# Altium schematic sheet BMS_Connectors.SchDoc: Connectors
size A4; SheetNumber: 2; SheetTotal: 5
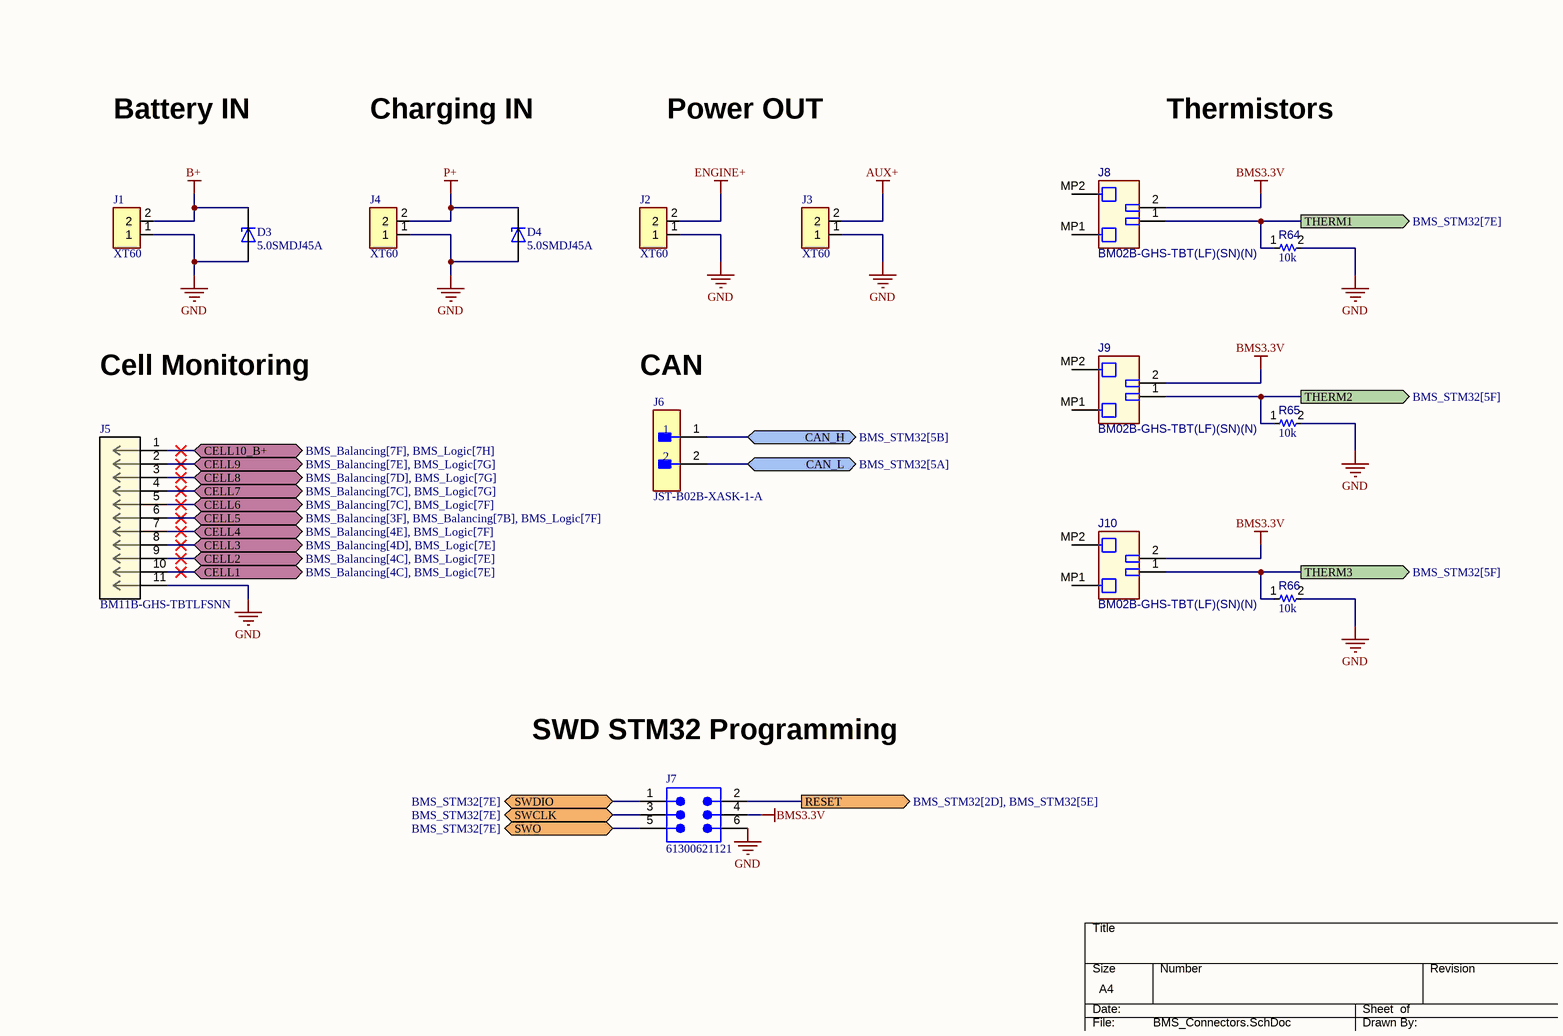
[diagram p0: BMS_Connectors.SchDoc]

## Parts
D3  5.0SMDJ45A  [DIOM7959X262N]
D4  5.0SMDJ45A  [DIOM7959X262N]
J1  XT60  [AMASS_XT60PB-M]
J2  XT60  [AMASS_XT60PB-M]
J3  XT60  [AMASS_XT60PB-M]
J4  XT60  [AMASS_XT60PB-M]
J5  BM11B-GHS-TBTLFSNN  [CONN11_BM11B-GHS-TBTLFSNN_JST]
J6  JST-B02B-XASK-1-A  [FP-B02B-XASK-1-A_LF_SN-MFG]
J7  61300621121  [61300621121]
J8  BM02B-GHS-TBT(LF)(SN)(N)  [JST-BM02B-GHS-TBT_V]
J9  BM02B-GHS-TBT(LF)(SN)(N)  [JST-BM02B-GHS-TBT_V]
J10  BM02B-GHS-TBT(LF)(SN)(N)  [JST-BM02B-GHS-TBT_V]
R64  value 10k  [RESC0402(1005)_L]  (hidden comment: RC0402FR-0710KL)
R65  value 10k  [RESC0402(1005)_L]  (hidden comment: RC0402FR-0710KL)
R66  value 10k  [RESC0402(1005)_L]  (hidden comment: RC0402FR-0710KL)

## Ports
CAN_H (bidir, see BMS_STM32[5B]), CAN_L (bidir, see BMS_STM32[5A]), CELL1 (bidir, see BMS_Balancing[4C], BMS_Logic[7E]), CELL2 (bidir, see BMS_Balancing[4C], BMS_Logic[7E]), CELL3 (bidir, see BMS_Balancing[4D], BMS_Logic[7E]), CELL4 (bidir, see BMS_Balancing[4E], BMS_Logic[7F]), CELL5 (bidir, see BMS_Balancing[3F], BMS_Balancing[7B], BMS_Logic[7F]), CELL6 (bidir, see BMS_Balancing[7C], BMS_Logic[7F]), CELL7 (bidir, see BMS_Balancing[7C], BMS_Logic[7G]), CELL8 (bidir, see BMS_Balancing[7D], BMS_Logic[7G]), CELL9 (bidir, see BMS_Balancing[7E], BMS_Logic[7G]), CELL10_B+ (bidir, see BMS_Balancing[7F], BMS_Logic[7H]), RESET (out, see BMS_STM32[2D], BMS_STM32[5E]), SWCLK (bidir, see BMS_STM32[7E]), SWDIO (bidir, see BMS_STM32[7E]), SWO (bidir, see BMS_STM32[7E]), THERM1 (out, see BMS_STM32[7E]), THERM2 (out, see BMS_STM32[5F]), THERM3 (out, see BMS_STM32[5F])

## Nets
AUX+: J3.2
B+: D3.C J1.2
BMS3.3V: J7.4 J8.2 J9.2 J10.2
ENGINE+: J2.2
GND: D3.A D4.A J1.1 J2.1 J3.1 J4.1 J5.11 J7.6 R64.2 R65.2 R66.2
P+: D4.C J4.2
CAN_H: J6.1 ; port CAN_H
CAN_L: J6.2 ; port CAN_L
CELL1: J5.10 ; port CELL1
CELL2: J5.9 ; port CELL2
CELL3: J5.8 ; port CELL3
CELL4: J5.7 ; port CELL4
CELL5: J5.6 ; port CELL5
CELL6: J5.5 ; port CELL6
CELL7: J5.4 ; port CELL7
CELL8: J5.3 ; port CELL8
CELL9: J5.2 ; port CELL9
CELL10_B+: J5.1 ; port CELL10_B+
RESET: J7.2 ; port RESET
SWCLK: J7.3 ; port SWCLK
SWDIO: J7.1 ; port SWDIO
SWO: J7.5 ; port SWO
THERM1: J8.1 R64.1 ; port THERM1
THERM2: J9.1 R65.1 ; port THERM2
THERM3: J10.1 R66.1 ; port THERM3

Not connected (* = marked no-connect by the designer): J8 MP1 MP2; J9 MP1 MP2; J10 MP1 MP2

## Notes on the sheet
- Battery IN
- Charging IN
- Power OUT
- Thermistors
- Cell Monitoring
- CAN
- SWD STM32 Programming
- DWG NO:
- REV:
- THIS DOCUMENT AND THE DATA DISCLOSED HEREIN OR
- HEREWITH IS THE PROPERTY OF ALTIUM LIMITED AND MAY
- BE FREELY DISTRIBUTED IN WHOLE. NO RIGHTS ARE
- RESERVED OR EXPRESS OR IMPLIED WARANTEE GIVEN.
- REVISION
- DESCRIPTION
- DATE
- APPROVED
- ENG:
- APPROVALS
- PROJECT
- DSN:
- CHK:
- REFERENCE DOCUMENTS
- PROJECT REVISION:
- TITLE
- DOCUMENT REVISION:
- DESIGN ITEM:
- BOM:
- FAB DWG:
- PCB DWG:
- ASSY DWG:
- SCALE:
- A2
- SIZE
- CAGE CODE
- FILE NAME
- DWG NO.
- SHEET
- OF
- REV

## Library data of the parts
D3 D4 = CMP-004-00034-2: 8.0SMDJ43CA-T7, Uni-Directional TVS Diode, 8000W, 2-Pin DO-214AB; MP: SMCJ48A; MF: Littelfuse Inc.; Design Item ID: 8.0SMDJ43CA-T7; SnapEDA_Link: https://www.snapeda.com/parts/SMCJ48A/Littelfuse/view-part/?ref=snap; Source: 8.0SMDJ43CA-T7.SchLib; Case/Package: DO-214 Littelfuse Inc.; Check_prices: https://www.snapeda.com/parts/SMCJ48A/Littelfuse/view-part/?ref=eda; Value: *
J1-J4 = CMP-011-000000-3: Power connector; 65A; PIN: 2; Colour: yellow; MF: Pololu; MP: XT60 YELLOW; Package: None; Availability: Not in stock; Check_prices: https://www.snapeda.com/parts/XT60%20YELLOW/Pololu/view-part/?ref=eda; Source: XT60_YELLOW.SchLib; Component Type: Standard; Value: *; SnapEDA_Link: https://www.snapeda.com/parts/XT60%20YELLOW/Pololu/view-part/?ref=snap; Price: None; Pin Count: 2; Design Item ID: XT60_YELLOW
J5 = CMP-168-000000-2: No Description Available; Manufacturer_Part_Number: BM11B-GHS-TBT(LF)(SN)(N); Manufacturer_Name: JST; RefDes: RefDes; Copyright: Copyright (C) 2025 Ultra Librarian. All rights reserved.; Design Item ID: BM11B-GHS-TBTLFSNN; Source: BM11B-GHS-TBTLFSNN.SchLib; Type: Type
J6 = CMP-002-00073-2: XA Series 2 Position 2.5mm Pitch Top Entry with Boss ThroughHole Shrouded Header
J7 = CMP-002-00076-2: WR-PHD Pin Header, THT, Vertical, pitch 2.54mm, 2 Row, 6P; Manufacturer: Wurth Elektronik; Contact Resistance: 20mOhm; Withstanding Voltage: 500V; Working Voltage: 250V; Rated Current: 3A; ComponentLink2URL: https://www.we-online.com/redexpert/spec/61300621121?ad; Operating Temperature Max: 105°C; Operating Temperature Min: -40°C; Match Code: WR-PHD; Pins: 6; Source: WR-PHD.SchLib; ComponentLink1URL: https://www.we-online.com/redexpert/article/61300621121?ad; Mount: Through Hole; Design Item ID: 61300621121; Orientation: Vertical; Manufacturer Part Number: 61300621121; Category: Board-to-Board Connectors; Pitch: 2.54mm; ComponentLink2Description: Datasheet Link; Packaging: Bag; Gender: Pin Header; ComponentLink1Description: Website Link; Pin Count: 6; Component Type: Standard; Number of Rows: 2
J8-J10 = CMP-002-00061-3: Disconnectable Crimp Style Connector, Pitch 1.25 mm, 1 x 2 Position, Height 4.05 mm, -25 to 85 degC, RoHS, Tape and Reel; Connector Type: Header,Shrouded; Mounting Technology: SurfaceMount; Case/Package: Disconnectable Crimp Style Connector, Pitch 1.25 mm, 1 x 2 Position, Height 4.05 mm; Pins: 4
R64-R66 = CMP-009-00065-4: 100R 0.063W 1% 0402 (1005 Metric)  SMD; Power: 63mW; Mounting Technology: SMT; Case/Package: 0402; Pins: 2; Tolerance: 1%